# EAGLE design gpr01 (EAGLE 9.6.2)
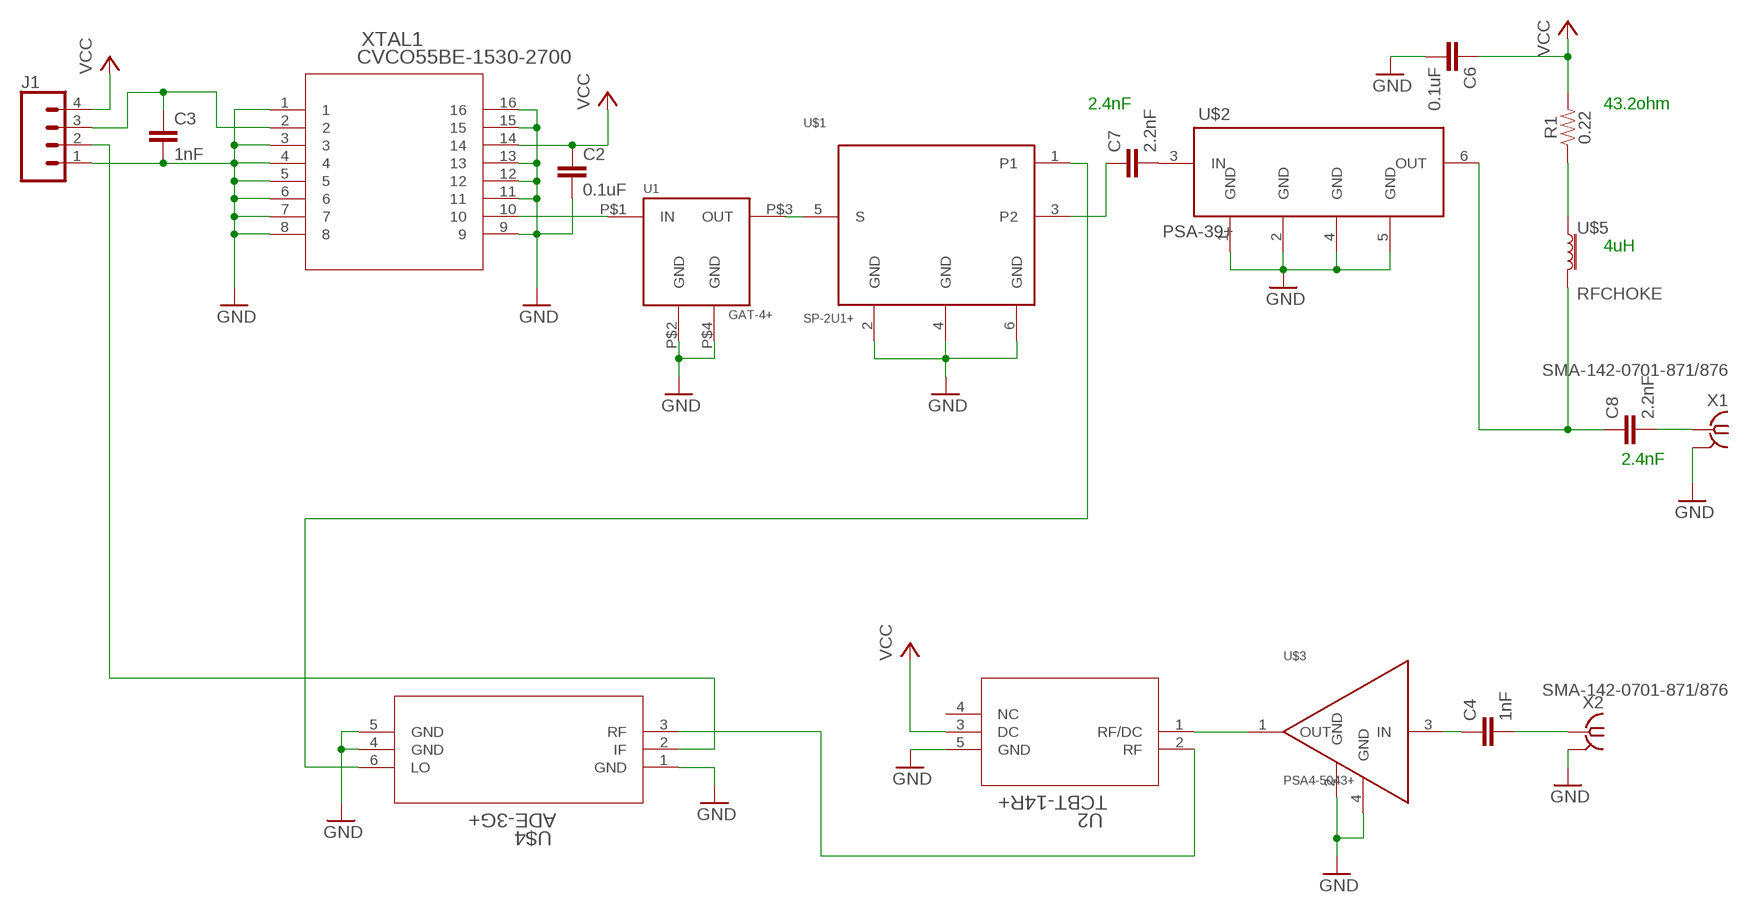
[diagram p0: schematic, sheet 1]

## Parts
C2  0.1uF  0.1UF-0402-16V-10%  [0402]
C3  1nF  1.0NF/1000PF-0603-50V-10%  [0603]
C4  1nF  1.0NF/1000PF-0603-50V-10%  [0603]
C6  0.1uF  0.1UF-0402-16V-10%  [0402]
C7  2.2nF  2.2NF/2200PF-0603-50V-10%  [0603]
C8  2.2nF  2.2NF/2200PF-0603-50V-10%  [0603]
J1  CONN_04POLAR  [MOLEX-1X4]
R1  0.22  0.22OHM-0805-1/4W-1%  [0805]
U1  GAT-4+  [GAT-4+]
U2  TCBT-14R+  [GU1414-2_MNC]
U$1  SP-2U1+  [SOT23-6]
U$2  PSA-39+  [SOT363_PHILIPS]
U$3  PSA4-5043+  [SOT343]
U$4  ADE-3G+  [CD542_MNC]
U$5  RFCHOKE  [1210]
X1  SMA-142-0701-871/876  [J502-ND-142-0701-871/876]
X2  SMA-142-0701-871/876  [J502-ND-142-0701-871/876]
XTAL1  CVCO55BE-1530-2700  [CVCO55BE-1530-2700_CRX]

## Nets
GND: C2.2 C3.2 C6.2 J1.1 U1.P$2(GND) U1.P$4(GND) U2.5(GND) U$1.2(GND) U$1.4(GND) U$1.6(GND) U$2.1(GND) U$2.2(GND) U$2.4(GND) U$2.5(GND) U$3.2(GND) U$3.4(GND) U$4.1(GND) U$4.4(GND) U$4.5(GND) X1.G@1 X1.G@2 X1.G@3 X1.G@4 X2.G@1 X2.G@2 X2.G@3 X2.G@4 XTAL1.1 XTAL1.3 XTAL1.4 XTAL1.5 XTAL1.6 XTAL1.7 XTAL1.8 XTAL1.9 XTAL1.11 XTAL1.12 XTAL1.13 XTAL1.15 XTAL1.16
N$1: U1.P$1(IN) XTAL1.10
N$2: C3.1 J1.3 XTAL1.2
N$3: U1.P$3(OUT) U$1.5(S)
N$4: C7.1 U$1.3(P2)
N$5: C7.2 U$2.3(IN)
N$6: R1.1 U$5.1
N$7: C8.1 U$2.6(OUT) U$5.2
N$8: C8.2 X1.1
N$9: C4.2 X2.1
N$10: C4.1 U$3.3(IN)
N$11: U2.1(RF/DC) U$3.1(OUT)
N$12: U2.2(RF) U$4.3(RF)
N$13: U$1.1 U$4.6(LO)
N$14: J1.2 U$4.2(IF)
VCC: C2.1 C6.1 J1.4 R1.2 U2.3(DC) XTAL1.14
Unconnected: U2.4(NC)

## Notes on the sheet
- 2.4nF | 43.2ohm
- 4uH
- 2.4nF

## Library data of the parts
C2 C6 = SparkFun-Capacitors:0.1UF: 0.1µF ceramic capacitors A capacitor is a passive two-terminal electrical component used to store electrical energy temporarily in an electric field.; PROD_ID: CAP-12416
C3 C4 = SparkFun-Capacitors:1.0NF/1000PF: 1nF/1,000pF ceramic capacitors A capacitor is a passive two-terminal electrical component used to store electrical energy temporarily in an electric field.; PROD_ID: CAP-07886
C7 C8 = SparkFun-Capacitors:2.2NF/2200PF: 2.2nF/2,200pF ceramic capacitors A capacitor is a passive two-terminal electrical component used to store electrical energy temporarily in an electric field.; PROD_ID: CAP-07877
J1 = SparkFun-Connectors:CONN_04: Multi connection point. Often used as Generic Header-pin footprint for 0.1 inch spaced/style header connections On any of the 0.1 inch spaced packages, you can populate with these: Break Away Headers - Straight <https://www.sparkfun.com/products/116> (PRT-00116) Break Away Male Headers - Right Angle <https://www.sparkfun.com/products/553> (PRT-00553) Female Headers <https://www.sparkfun.com/products/115> (PRT-00115) Break Away Headers - Machine Pin <https://www.sparkfun.com/products/117> (PRT-00117) Break Away Female Headers - Swiss Machine Pin <https://www.sparkfun.com/products/743> (PRT-00743) For SCREWTERMINALS and SPRING TERMINALS visit here: Screw Terimnals on SparkFun.com <https://www.sparkfun.com/search/results?term=Screw+Terminals> (5mm/3.5mm/2.54mm spacing) This device is also useful as a general connection point to wire up your design to another part of your project. Our various solder wires solder well into these plated through hole pads. Hook-Up Wire - Assortment (Stranded, 22 AWG) <https://www.sparkfun.com/products/11375> (PRT-11375) Hook-Up Wire - Assortment (Solid Core, 22 AWG) <https://www.sparkfun.com/products/11367> (PRT-11367) View the entire wire category on our website here <https://www.sparkfun.com/categories/141> Special notes: Molex polarized connector foot print use with SKU : PRT-08231 with associated crimp pins and housings. 1MM SMD Version SKU: PRT-10208; PROD_ID: CONN-08186; SF_ID: PRT-08231
R1 = SparkFun-Resistors:0.22OHM: 0.22Ω resistor A resistor is a passive two-terminal electrical component that implements electrical resistance as a circuit element. Resistors act to reduce current flow, and, at the same time, act to lower voltage levels within circuits. - Wikipedia; PROD_ID: RES-09883
U1 = vco:GAT-4+: GAT-4+ attenuator
U2 = vco:TCBT-14R+: TCBT-14+; BUILT_BY: EMA_Cory; COPYRIGHT: Copyright (C) 2018 Accelerated Designs. All rights reserved; DATASHEET: https://www.minicircuits.com/pdfs/TCBT-14R+.pdf; MANUFACTURER_PART_NUMBER: TCBT-14R+; SOURCELIBRARY: Mini_Circuits_2020-04-14; VENDOR: Mini Circuits
U$1 = vco:SP-2U1+: MiniCircuits Power Splitter
U$2 = vco:PSA-39+: PSA-39+ amplifier
U$3 = vco:PSA4-5043+: PSA4-5043+
U$4 = ade_3g:ADE-3G+: ADE-3G+
U$5 = vco:RFCHOKE: RF choke with 1210 package like https://www.digikey.com/en/products/detail/tdk-corporation/NLV32T-3R9J-EFD/4741527
X1 X2 = con-coax:SMA-: SMA 50 Ohm End Launch Jack Receptacle - Round Contact Johnson Components Source: www.johnsoncomponents.com .. J502-ND.pdf; MF: JOHNSON COMPONENTS; MPN: 142-0701-871; OC_FARNELL: 1339835; OC_NEWARK: 91B6105
XTAL1 = vco:CVCO55BE-1530-2700; BUILT_BY: EMA_Colton; COPYRIGHT: Copyright (C) 2018 Accelerated Designs. All rights reserved; DATASHEET: https://datasheet.octopart.com/CVCO55BE-1530-2700-Crystek-Crystals-datasheet-57461.pdf; MANUFACTURER_PART_NUMBER: CVCO55BE-1530-2700; SOURCELIBRARY: Crystek_Crystals_2020-01-30; VENDOR: Crystek Crystals

## Board
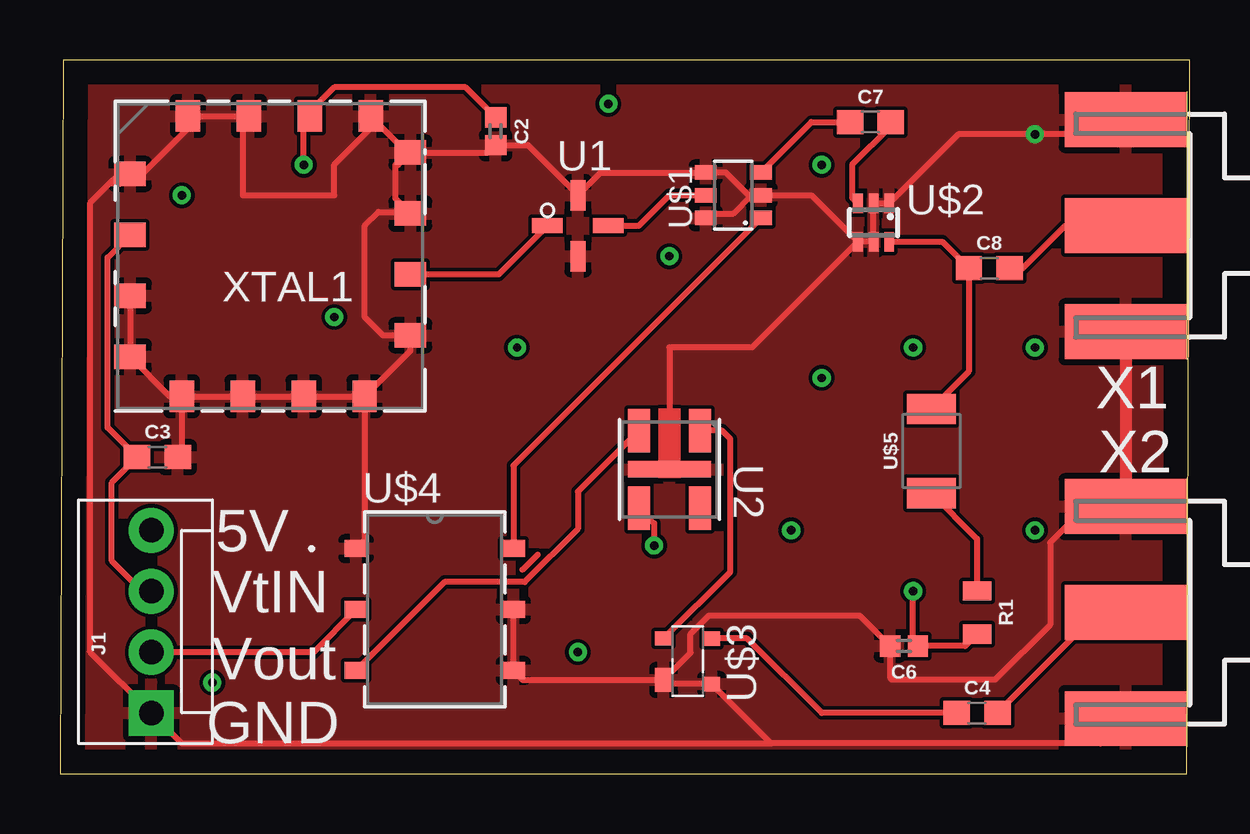
[diagram p1: board, top side]
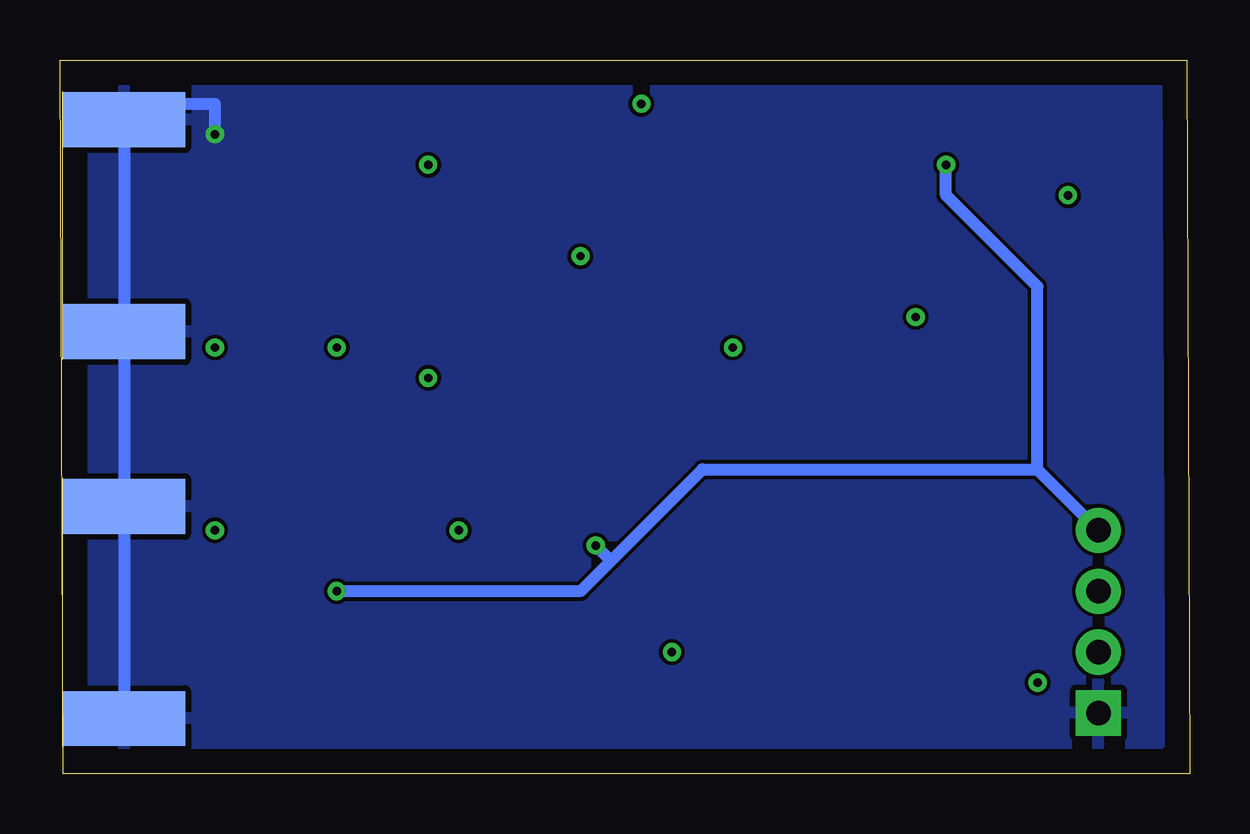
[diagram p2: board, bottom side, seen from below]

Size 47.1 x 29.77 mm. Coordinates in mm from the lower left corner, seen from the top.
Outline: 0,0 46.97,0 47.1,29.77 0.13,29.77 0,0
Copper layers (1*16): Top 0.035mm / dielectric 0.15mm / Bottom 0.035mm
Design rules "default": minimum track width 6mil, minimum drill 0.35mm, track to track 6mil, track to pad 6mil, pad to pad 6mil, via to via 6mil, smd to smd 6mil, copper to edge 40mil, drill to drill 6mil, minimum pad ring 10mil, minimum via ring 8mil, stop-mask expansion 4mil, vias tented up to drill 0mil, thermal gap 10mil

### Footprints (pad centres in the part's own frame; a part is rotated, then mirrored left to right if it is on the bottom)
0402 = smd 0.85 x 0.9: 1 -0.58,0; 2 0.58,0
0603 = smd 1.1 x 1: 1 -0.85,0; 2 0.85,0
MOLEX-1X4 = drill 1.016 pad 1.88 square: 1 0,0 | drill 1.016 pad 1.88: 2 2.54,0; 3 5.08,0; 4 7.62,0
0805 = smd 0.8 x 1.2: 1 -0.9,0; 2 0.9,0
GAT-4+ = smd 0.635 x 1.27: P$1 0,-1.27; P$3 0,1.27 | smd 1.27 x 0.635: P$2 1.27,0; P$4 -1.27,0
GU1414-2_MNC = smd 1.803 x 0.914: 1 -1.613,1.27; 2 -1.613,-1.27; 3 1.613,-1.27; 4 1.613,1.27 | smd 0.686 x 3.454: 5 0,0
SOT23-6 = smd 0.6 x 0.9: 1 -0.95,-1.15; 2 0,-1.15; 3 0.95,-1.15; 4 0.95,1.15; 5 0,1.15; 6 -0.95,1.15
SOT363_PHILIPS = smd 0.4 x 0.8: 1 -0.65,-0.8; 2 0,-0.8; 3 0.65,-0.8; 4 0.65,0.8; 5 0,0.8; 6 -0.65,0.8
SOT343 = smd 0.6 x 0.7: 1 -0.955,-1; 3 -0.95,1; 4 0.95,1 | smd 1 x 0.7: 2 0.774,-1
CD542_MNC = smd 0.965 x 0.711: 1 -3.277,2.54; 2 -3.277,0; 3 -3.277,-2.54; 4 3.277,-2.54; 5 3.277,0; 6 3.277,2.54
1210 = smd 1.27 x 2.06: 1 -1.755,0; 2 1.755,0
J502-ND-142-0701-871/876 = smd 5.08 x 2.286: 1 2.565,0; G@1 2.565,4.42; G@2 2.565,-4.42 | smd 5.08 x 2.286 bottom: G@3 2.565,4.42; G@4 2.565,-4.42
CVCO55BE-1530-2700_CRX = smd 1.321 x 1.016: 1 -5.842,3.429; 2 -5.842,0.889; 3 -5.842,-1.651; 4 -5.842,-4.191; 9 5.842,-3.302; 10 5.842,-0.762; 11 5.842,1.778; 12 5.842,4.318 | smd 1.016 x 1.321: 5 -3.683,-5.842; 6 -1.143,-5.842; 7 1.397,-5.842; 8 3.937,-5.842; 13 4.191,5.842; 14 1.651,5.842; 15 -0.889,5.842; 16 -3.429,5.842

### Placement (x,y rotation side)
C2  18.16,26.8 270 top
C3  4.06,13.21 0 top
C4  38.23,2.54 0 top
C6  35.18,5.33 180 top
C7  33.78,27.18 0 top
C8  38.73,21.08 0 top
J1  3.81,2.54 90 top
R1  38.23,6.73 270 top
U1  21.59,22.86 270 top
U2  25.4,12.7 270 top
U$1  28.07,24.13 90 top
U$2  33.91,22.99 180 top
U$3  26.16,4.7 270 top
U$4  15.62,6.86 0 top
U$5  36.32,13.46 90 top
X1  46.99,22.86 180 top
X2  46.99,6.73 180 top
XTAL1  8.76,21.59 0 top

### Tracks (layer width: path | path; a pad name or v marks a point on that pad's centre or on a via)
GND  (via drill 0.35)
  Top 0.254: XTAL1.11 14.54,23.43 | 14.54,23.43 13.97,24 13.97,25.4 14.1,25.4 XTAL1.12 | XTAL1.3 XTAL1.4 4.57,15.75 XTAL1.5 | XTAL1.5 XTAL1.6 XTAL1.7 XTAL1.8 | XTAL1.8 14.61,17.65 XTAL1.9 13.46,18.29 12.7,19.05 12.7,22.86 13.27,23.43 14.54,23.43 | XTAL1.5 5.08,13.37 C3.2 | XTAL1.8 12.7,9.75 U$4.1 | U$4.5 U$4.4 19.29,3.93 U$3.2 | XTAL1.12 17.85,25.91 C2.2 19.5,26.22 U1.P$4 22.54,25.08 U$1.4 27.75,25.08 28.7,24.13 28.83,24.13 | 28.83,24.13 U$1.2 31.32,24.13 U$2.4 | U$1.6 27.11,23.37 28.07,23.37 28.83,24.13 | U$3.2 25.34,3.75 U$3.4 29.64,1.27 | 44.45,2.29 X2.G@3 43.38,1.27 29.64,1.27 | 29.64,1.27 5.08,1.27 J1.1 1.27,5.08 1.27,23.82 2.06,24.61 | U$2.4 U$2.5 U$2.2 U$2.1 37.44,26.67 v40.64,26.67 43.81,26.67 X1.G@4 | U$3.2 26.29,5.05 26.29,5.84 27.05,6.6 33.33,6.6 C6.2 34.6,4.01 34.67,3.94 38.99,3.94 41.27,6.22 41.27,9.65 42.77,11.15 X2.G@4 44.42,11.3 42.93,11.3 | 2.06,24.61 2.45,24.99 | XTAL1.12 14.48,25.91 XTAL1.13 12.95,26.92 11.43,25.4 11.43,24.13 7.62,24.13 7.62,27.18 XTAL1.15 XTAL1.16 5.33,26.92 3.43,25.02 XTAL1.1 2.51,24.61 2.06,24.61 | U$2.4 28.85,17.78 25.4,17.78 U2.5
  Top 0.508: X1.G@3 X2.G@4
  Bottom 0.508: X2.G@3 X2.G@4 X1.G@3 X1.G@4 42.57,27.28 41.91,27.94 40.64,27.94 v40.64,26.67
  pour Top (isolate 0): 0,29.21 46.99,29.21 46.99,0 0,0
  pour Bottom (isolate 0): 1.27,29.21 45.72,29.21 45.72,1.27 1.27,1.27
N$1
  Top 0.254: U1.P$1 18.29,20.83 XTAL1.10
N$2
  Top 0.254: J1.3 3.43,7.62 2.16,8.89 2.16,12.15 C3.1 1.98,14.44 1.98,21.54 XTAL1.2
N$3
  Top 0.254: U1.P$3 24.13,22.86 25.4,24.13 U$1.5
N$4
  Top 0.254: U$1.3 31.32,27.18 C7.1
N$5
  Top 0.254: C7.2 34.63,27.01 33.02,25.4 33.02,24.03 U$2.3
N$6
  Top 0.254: U$5.1 38.23,9.8 R1.1
N$7
  Top 0.254: U$2.6 36.78,22.19 C8.1 37.88,16.78 U$5.2
N$8
  Top 0.254: C8.2 40.13,21.08 41.91,22.86 X1.1
N$9
  Top 0.254: C4.2 43.27,6.73 X2.1
N$10
  Top 0.254: C4.1 31.75,2.54 28.64,5.65 U$3.3
N$11
  Top 0.254: U$3.1 27.94,8.43 27.94,13.97 27.6,14.31 U2.1
N$12
  Top 0.254: U$4.3 16.03,8 19.37,8 21.59,10.22 21.59,11.77 U2.2
N$13
  Top 0.254: U$1.1 18.9,12.86 U$4.6
N$14
  Top 0.254: J1.2 10.57,5.08 U$4.2
N$15  (via drill 0.35)
  other vias: 11.43,19.05
N$16  (via drill 0.35)
  other vias: 5.08,24.13
N$17  (via drill 0.35)
  other vias: 25.4,21.59
N$18  (via drill 0.35)
  other vias: 31.75,25.4
N$19  (via drill 0.35)
  other vias: 35.56,17.78
N$20  (via drill 0.35)
  other vias: 19.05,17.78
N$21  (via drill 0.35)
  other vias: 31.75,16.51
N$22  (via drill 0.35)
  other vias: 30.48,10.16
N$23  (via drill 0.35)
  other vias: 21.59,5.08
N$24  (via drill 0.35)
  other vias: 6.35,3.81
N$25  (via drill 0.35)
  other vias: 40.64,10.16
N$26  (via drill 0.35)
  other vias: 40.64,17.78
N$27  (via drill 0.35)
  other vias: 22.86,27.94
N$28
  Top 0.254: 19.91,9.14 19.28,8.51
VCC  (via drill 0.35)
  Top 0.254: C2.1 16.91,28.63 11.43,28.63 10.41,27.61 XTAL1.14 | R1.2 37.73,5.33 C6.1 35.56,5.53 v35.56,7.62 | XTAL1.14 10.41,27.22 | U2.3 24.77,10.45 v24.77,9.53 | v10.16,25.4 10.16,27.18 XTAL1.14
  Bottom 0.254: 24.13,8.89 24.31,8.89
  Bottom 0.508: J1.4 6.35,12.7 | 6.35,12.7 20.32,12.7 24.13,8.89 | 24.13,8.89 25.4,7.62 v35.56,7.62 | 6.35,12.7 6.35,20.32 10.16,24.13 v10.16,25.4 | 24.13,8.89 v24.77,9.53

### Text on the board
tPlace: 5V | VtIN | Vout | GND